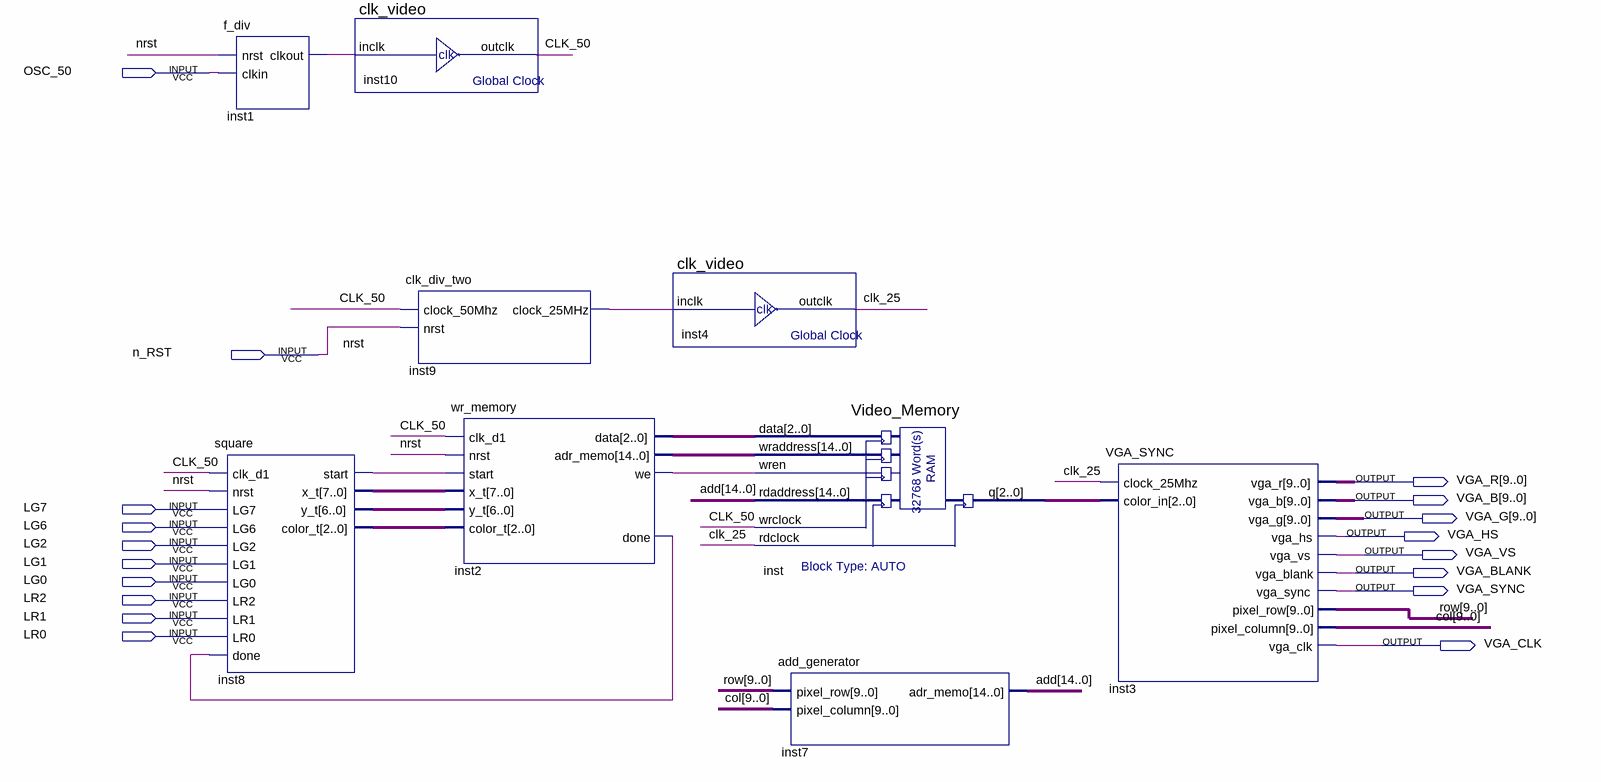
[diagram p0: schematic sheet]
// Quartus schematic VGA.bdf as structural Verilog: 9 symbols, 18 pins
module VGA (
  input  OSC_50,
  input  n_RST,
  input  LG7,
  input  LG6,
  input  LG2,
  input  LG1,
  input  LG0,
  input  LR2,
  input  LR1,
  input  LR0,
  output [9:0] VGA_R,
  output [9:0] VGA_B,
  output [9:0] VGA_G,
  output VGA_HS,
  output VGA_VS,
  output VGA_BLANK,
  output VGA_SYNC,
  output VGA_CLK
);

  wire clk_25, CLK_50, inst1_clkout, inst2_done, inst2_we, inst8_start, inst9_clock_25mhz;
  wire [2:0] inst2_data, inst8_color_t, inst_q;
  wire [6:0] inst8_y_t;
  wire [7:0] inst8_x_t;
  wire [9:0] col, row;
  wire [14:0] add, inst2_adr_memo;

  f_div inst1 (.nrst(n_RST), .clkin(OSC_50), .clkout(inst1_clkout));
  square inst8 (
    .clk_d1(CLK_50), .nrst(n_RST), .LG7(LG7), .LG6(LG6), .LG2(LG2), .LG1(LG1), .LG0(LG0), .LR2(LR2),
    .LR1(LR1), .LR0(LR0), .done(inst2_done), .x_t(inst8_x_t), .y_t(inst8_y_t), .color_t(inst8_color_t),
    .start(inst8_start));
  clk_video inst10 (.inclk(inst1_clkout), .outclk(CLK_50));
  clk_div_two inst9 (.clock_50Mhz(CLK_50), .nrst(n_RST), .clock_25MHz(inst9_clock_25mhz));
  wr_memory inst2 (
    .clk_d1(CLK_50), .start(inst8_start), .nrst(n_RST), .x_t(inst8_x_t), .y_t(inst8_y_t),
    .color_t(inst8_color_t), .we(inst2_we), .done(inst2_done), .data(inst2_data), .adr_memo(inst2_adr_memo));
  clk_video inst4 (.inclk(inst9_clock_25mhz), .outclk(clk_25));
  Video_Memory inst (
    .data(inst2_data), .wraddress(inst2_adr_memo), .wren(inst2_we), .rdaddress(add), .wrclock(CLK_50),
    .rdclock(clk_25), .q(inst_q));
  add_generator inst7 (.pixel_row(row), .pixel_column(col), .adr_memo(add));
  VGA_SYNC inst3 (
    .clock_25Mhz(clk_25), .color_in(inst_q), .vga_r(VGA_R), .vga_b(VGA_B), .vga_g(VGA_G), .vga_hs(VGA_HS),
    .vga_vs(VGA_VS), .vga_blank(VGA_BLANK), .vga_sync(VGA_SYNC), .pixel_row(row), .pixel_column(col),
    .vga_clk(VGA_CLK));

  // Other names for the same wires on the sheet: nrst = n_RST
endmodule
